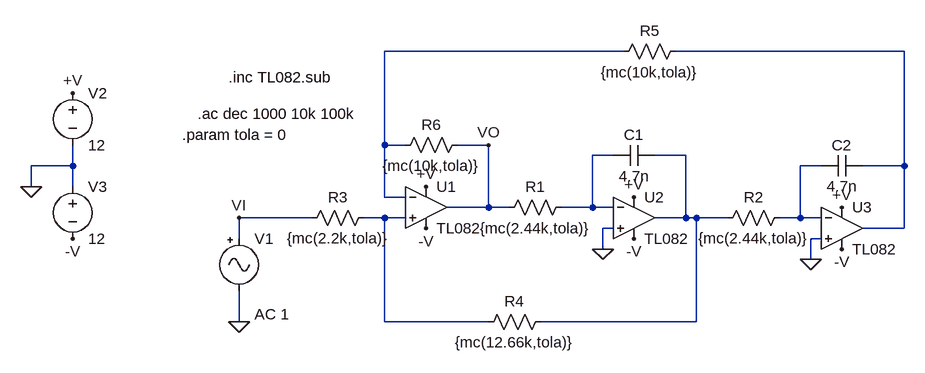
[diagram p0: schematic Circuito2V2.asc]
Circuito2V2.asc, the LTspice schematic file:
Version 4
SHEET 1 1160 680
WIRE 336 -96 -32 -96
WIRE 768 -96 416 -96
WIRE -32 48 -32 -96
WIRE 0 48 -32 48
WIRE 128 48 80 48
WIRE 320 64 288 64
WIRE 432 64 384 64
WIRE -512 80 -512 48
WIRE -512 80 -576 80
WIRE 640 80 608 80
WIRE 768 80 768 -96
WIRE 768 80 704 80
WIRE -576 112 -576 80
WIRE -512 112 -512 80
WIRE -32 128 -32 48
WIRE 0 128 -32 128
WIRE 128 144 128 48
WIRE 128 144 64 144
WIRE 160 144 128 144
WIRE 288 144 288 64
WIRE 288 144 240 144
WIRE 320 144 288 144
WIRE -144 160 -256 160
WIRE -32 160 -64 160
WIRE 0 160 -32 160
WIRE 432 160 432 64
WIRE 432 160 384 160
WIRE 448 160 432 160
WIRE 496 160 448 160
WIRE 608 160 608 80
WIRE 608 160 576 160
WIRE 640 160 608 160
WIRE 320 176 304 176
WIRE 768 176 768 80
WIRE 768 176 704 176
WIRE -256 192 -256 160
WIRE 640 192 624 192
WIRE 304 208 304 176
WIRE 624 224 624 192
WIRE -256 320 -256 272
WIRE -32 320 -32 160
WIRE 128 320 -32 320
WIRE 448 320 448 160
WIRE 448 320 208 320
FLAG 304 208 0
FLAG 624 224 0
FLAG -256 320 0
FLAG 128 48 VO
FLAG -256 160 VI
FLAG -576 112 0
FLAG -512 -32 +V
FLAG 32 112 +V
FLAG 352 128 +V
FLAG 672 144 +V
FLAG -512 192 -V
FLAG 32 176 -V
FLAG 352 192 -V
FLAG 672 208 -V
SYMBOL res 256 128 R90
WINDOW 0 0 56 VBottom 2
WINDOW 3 32 56 VTop 2
SYMATTR InstName R1
SYMATTR Value {mc(2.44k,tola)}
SYMBOL res 592 144 R90
WINDOW 0 0 56 VBottom 2
WINDOW 3 32 56 VTop 2
SYMATTR InstName R2
SYMATTR Value {mc(2.44k,tola)}
SYMBOL res -48 144 R90
WINDOW 0 0 56 VBottom 2
WINDOW 3 32 56 VTop 2
SYMATTR InstName R3
SYMATTR Value {mc(2.2k,tola)}
SYMBOL res 224 304 R90
WINDOW 0 0 56 VBottom 2
WINDOW 3 32 56 VTop 2
SYMATTR InstName R4
SYMATTR Value {mc(12.66k,tola)}
SYMBOL res 432 -112 R90
WINDOW 0 0 56 VBottom 2
WINDOW 3 32 56 VTop 2
SYMATTR InstName R5
SYMATTR Value {mc(10k,tola)}
SYMBOL res 96 32 R90
WINDOW 0 0 56 VBottom 2
WINDOW 3 32 56 VTop 2
SYMATTR InstName R6
SYMATTR Value {mc(10k,tola)}
SYMBOL cap 384 48 R90
WINDOW 0 0 32 VBottom 2
WINDOW 3 32 32 VTop 2
SYMATTR InstName C1
SYMATTR Value 4.7n
SYMBOL cap 704 64 R90
WINDOW 0 0 32 VBottom 2
WINDOW 3 32 32 VTop 2
SYMATTR InstName C2
SYMATTR Value 4.7n
SYMBOL Misc\\signal -256 176 R0
WINDOW 123 24 132 Left 2
WINDOW 39 0 0 Left 2
SYMATTR Value2 AC 1
SYMATTR InstName V1
SYMATTR Value ""
SYMBOL Opamps\\opamp2 32 80 R0
SYMATTR InstName U1
SYMATTR Value TL082
SYMBOL Opamps\\opamp2 352 96 R0
SYMATTR InstName U2
SYMATTR Value TL082
SYMBOL Opamps\\opamp2 672 112 R0
SYMATTR InstName U3
SYMATTR Value TL082
SYMBOL voltage -512 -48 R0
WINDOW 123 0 0 Left 2
WINDOW 39 0 0 Left 2
SYMATTR InstName V2
SYMATTR Value 12
SYMBOL voltage -512 96 R0
WINDOW 123 0 0 Left 2
WINDOW 39 0 0 Left 2
SYMATTR InstName V3
SYMATTR Value 12
TEXT -272 -56 Left 2 !.inc TL082.sub
TEXT -320 0 Left 2 !.ac dec 1000 10k 100k
TEXT -344 32 Left 2 !.param tola = 0

The netlist it stands for:
* Circuito2V2.asc
R1 N003 VO {mc(2.44k,tola)}
R2 N005 N004 {mc(2.44k,tola)}
R3 N006 VI {mc(2.2k,tola)}
R4 N004 N006 {mc(12.66k,tola)}
R5 N002 N001 {mc(10k,tola)}
R6 VO N001 {mc(10k,tola)}
C1 N004 N003 4.7n
C2 N002 N005 4.7n
V1 VI 0 AC 1
XU1 N006 N001 +V -V VO TL082  ; pins In+ In- V+ V- OUT
XU2 0 N003 +V -V N004 TL082  ; pins In+ In- V+ V- OUT
XU3 0 N005 +V -V N002 TL082  ; pins In+ In- V+ V- OUT
V2 +V 0 12
V3 0 -V 12
.inc TL082.sub
.ac dec 1000 10k 100k
.param tola = 0
.backanno
.end